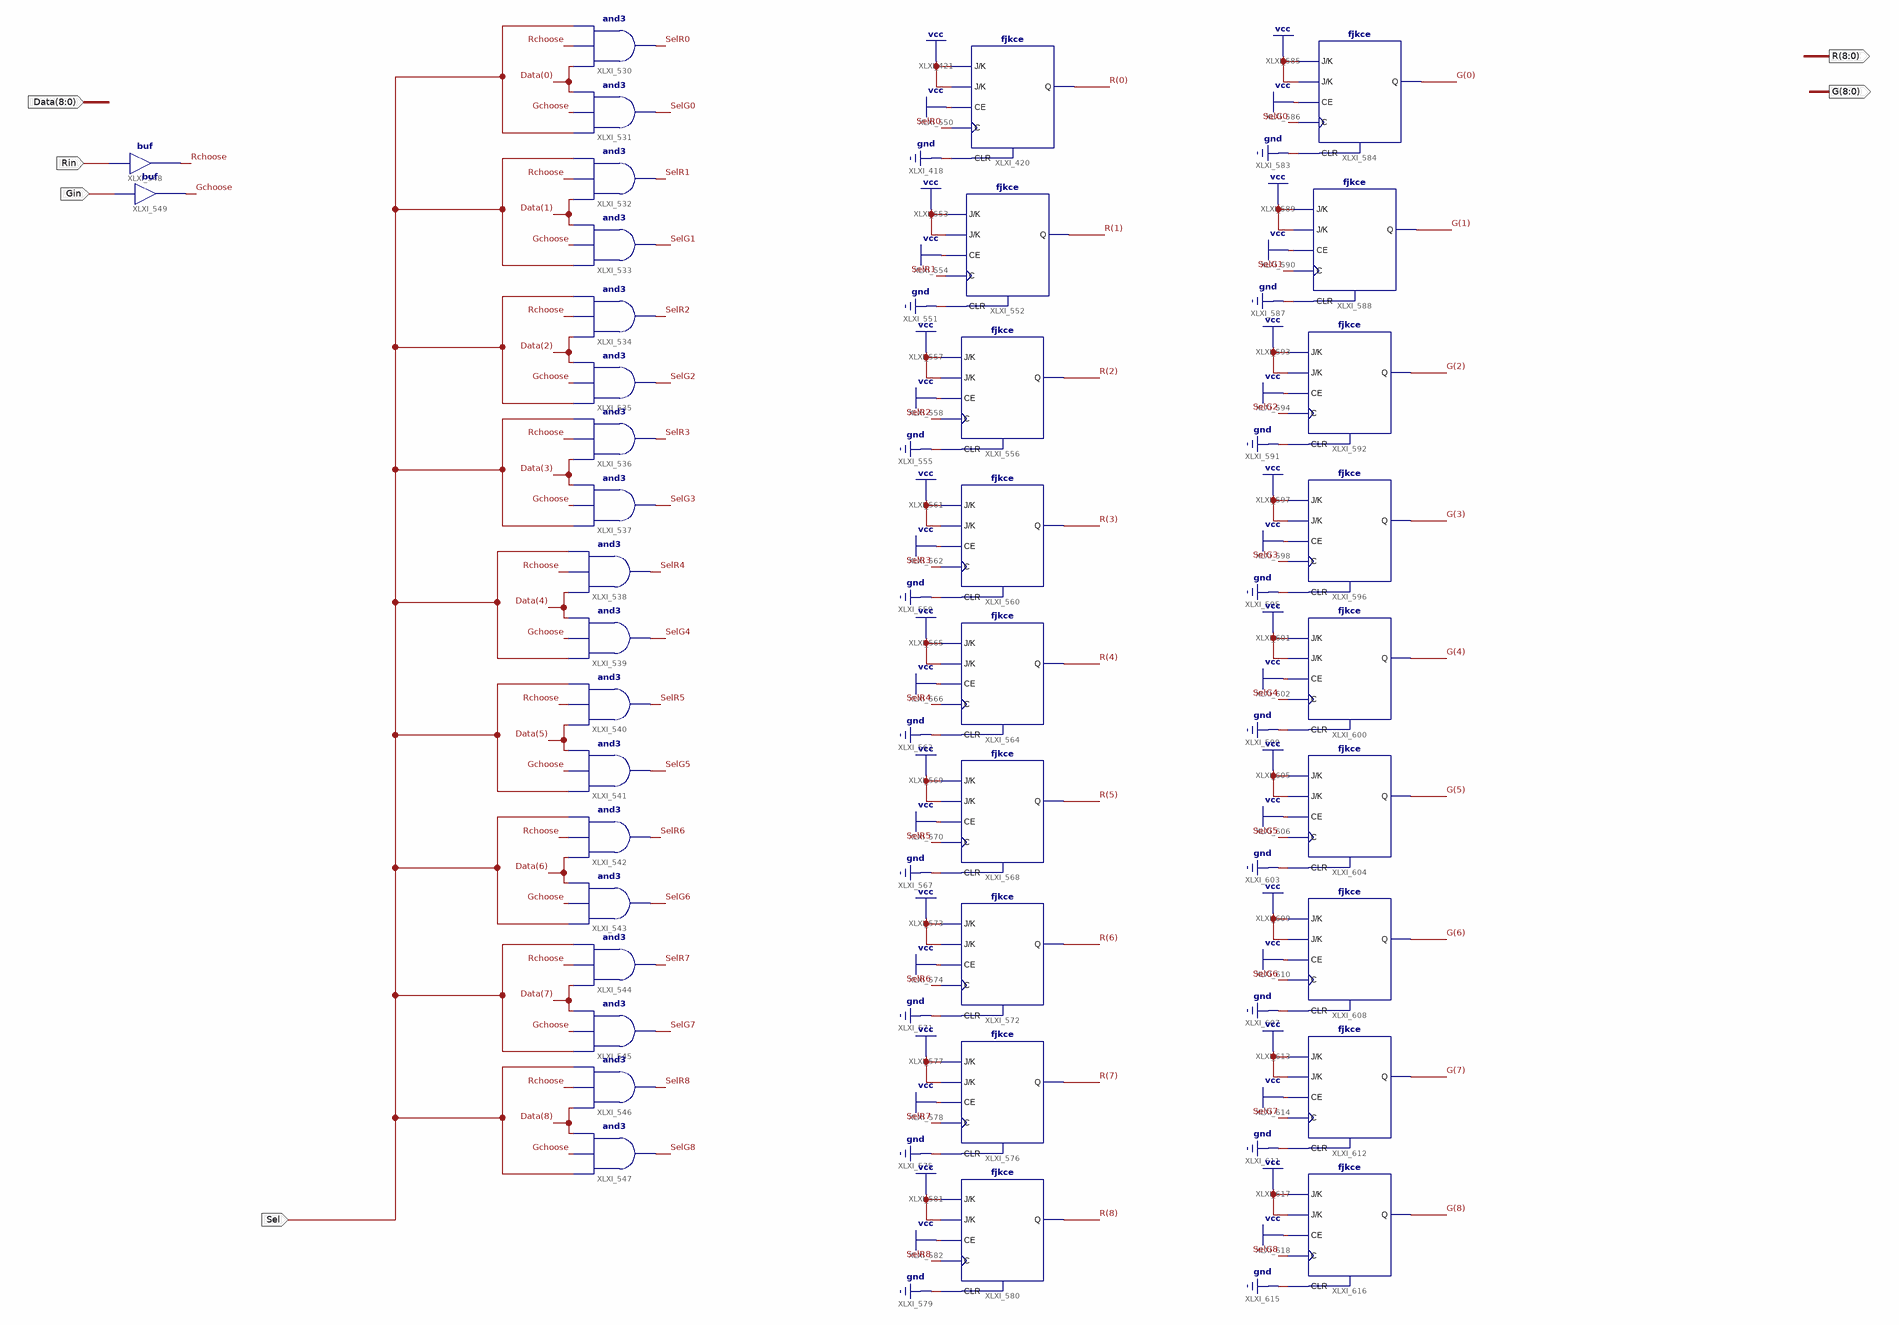
[diagram p0: schematic sheet 1]
// Xilinx ISE schematic RorG.sch (spartan6) as structural Verilog: 38 symbols, 6 ports
module RorG (
  input  [8:0] Data,
  input  Rin,
  input  Gin,
  input  Sel,
  output [8:0] R,
  output [8:0] G
);

  wire Gchoose, Rchoose, SelG0, SelG1, SelG2, SelG3, SelG4, SelG5, SelG6, SelG7, SelG8, SelR0, SelR1, SelR2,
       SelR3, SelR4, SelR5, SelR6, SelR7, SelR8;

  fjkce XLXI_420 (.C(SelR0), .CE(1'b1), .CLR(1'b0), .J(1'b1), .K(1'b1), .Q(R[0]));
  buf XLXI_548 (Rchoose, Rin);
  buf XLXI_549 (Gchoose, Gin);
  and XLXI_530 (SelR0, Data[0], Rchoose, Sel);
  and XLXI_531 (SelG0, Sel, Gchoose, Data[0]);
  and XLXI_532 (SelR1, Data[1], Rchoose, Sel);
  and XLXI_533 (SelG1, Sel, Gchoose, Data[1]);
  and XLXI_534 (SelR2, Data[2], Rchoose, Sel);
  and XLXI_535 (SelG2, Sel, Gchoose, Data[2]);
  and XLXI_536 (SelR3, Data[3], Rchoose, Sel);
  and XLXI_537 (SelG3, Sel, Gchoose, Data[3]);
  and XLXI_538 (SelR4, Data[4], Rchoose, Sel);
  and XLXI_539 (SelG4, Sel, Gchoose, Data[4]);
  and XLXI_540 (SelR5, Data[5], Rchoose, Sel);
  and XLXI_541 (SelG5, Sel, Gchoose, Data[5]);
  and XLXI_542 (SelR6, Data[6], Rchoose, Sel);
  and XLXI_543 (SelG6, Sel, Gchoose, Data[6]);
  and XLXI_544 (SelR7, Data[7], Rchoose, Sel);
  and XLXI_545 (SelG7, Sel, Gchoose, Data[7]);
  and XLXI_546 (SelR8, Data[8], Rchoose, Sel);
  and XLXI_547 (SelG8, Sel, Gchoose, Data[8]);
  fjkce XLXI_552 (.C(SelR1), .CE(1'b1), .CLR(1'b0), .J(1'b1), .K(1'b1), .Q(R[1]));
  fjkce XLXI_556 (.C(SelR2), .CE(1'b1), .CLR(1'b0), .J(1'b1), .K(1'b1), .Q(R[2]));
  fjkce XLXI_560 (.C(SelR3), .CE(1'b1), .CLR(1'b0), .J(1'b1), .K(1'b1), .Q(R[3]));
  fjkce XLXI_564 (.C(SelR4), .CE(1'b1), .CLR(1'b0), .J(1'b1), .K(1'b1), .Q(R[4]));
  fjkce XLXI_568 (.C(SelR5), .CE(1'b1), .CLR(1'b0), .J(1'b1), .K(1'b1), .Q(R[5]));
  fjkce XLXI_572 (.C(SelR6), .CE(1'b1), .CLR(1'b0), .J(1'b1), .K(1'b1), .Q(R[6]));
  fjkce XLXI_576 (.C(SelR7), .CE(1'b1), .CLR(1'b0), .J(1'b1), .K(1'b1), .Q(R[7]));
  fjkce XLXI_580 (.C(SelR8), .CE(1'b1), .CLR(1'b0), .J(1'b1), .K(1'b1), .Q(R[8]));
  fjkce XLXI_584 (.C(SelG0), .CE(1'b1), .CLR(1'b0), .J(1'b1), .K(1'b1), .Q(G[0]));
  fjkce XLXI_588 (.C(SelG1), .CE(1'b1), .CLR(1'b0), .J(1'b1), .K(1'b1), .Q(G[1]));
  fjkce XLXI_592 (.C(SelG2), .CE(1'b1), .CLR(1'b0), .J(1'b1), .K(1'b1), .Q(G[2]));
  fjkce XLXI_596 (.C(SelG3), .CE(1'b1), .CLR(1'b0), .J(1'b1), .K(1'b1), .Q(G[3]));
  fjkce XLXI_600 (.C(SelG4), .CE(1'b1), .CLR(1'b0), .J(1'b1), .K(1'b1), .Q(G[4]));
  fjkce XLXI_604 (.C(SelG5), .CE(1'b1), .CLR(1'b0), .J(1'b1), .K(1'b1), .Q(G[5]));
  fjkce XLXI_608 (.C(SelG6), .CE(1'b1), .CLR(1'b0), .J(1'b1), .K(1'b1), .Q(G[6]));
  fjkce XLXI_612 (.C(SelG7), .CE(1'b1), .CLR(1'b0), .J(1'b1), .K(1'b1), .Q(G[7]));
  fjkce XLXI_616 (.C(SelG8), .CE(1'b1), .CLR(1'b0), .J(1'b1), .K(1'b1), .Q(G[8]));
endmodule
